# EAGLE design ESPF (EAGLE 9.6.2)
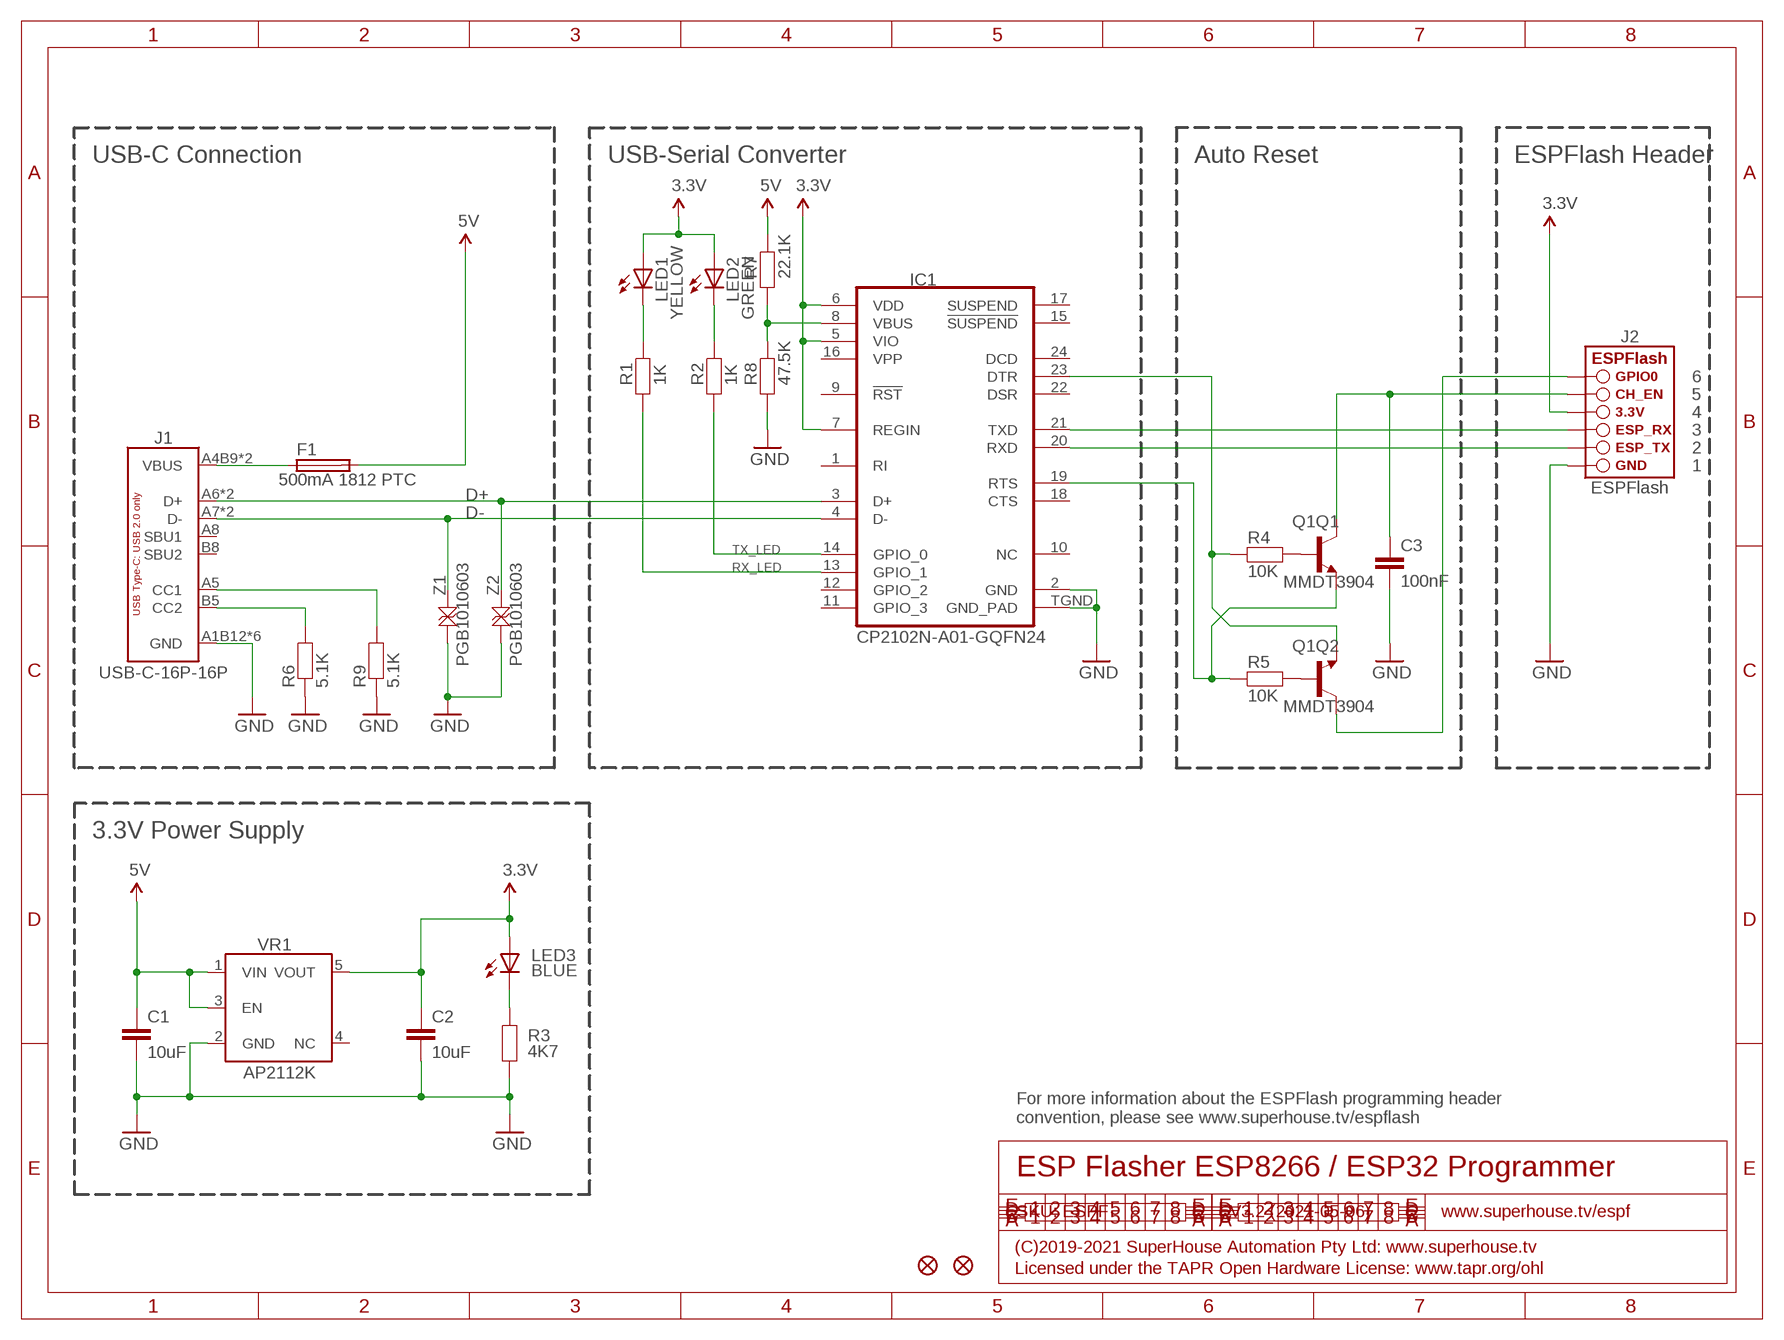
[diagram p0: schematic, sheet 1]

## Parts
C1  10uF  CAP0603  [C0603]
C2  10uF  CAP0603  [C0603]
C3  100nF  CAP0603  [C0603]
F1  500mA 1812 PTC  PTC050  [1812]
FID1  FIDUCIAL1X2.5  [FIDUCIAL-1X2.5]
FID2  FIDUCIAL1X2.5  [FIDUCIAL-1X2.5]
IC1  CP2102N-A01-GQFN24  CP2104  [QFN-24]
J1  USB-C-16P-16P  [USB-C-16P]
J2  ESPFLASH-1X6-2.54-PINS-RA  [1X6-2.54-PINS-RA]
LED1  YELLOW  LED0603  [LED-0603]
LED2  GREEN  LED0603  [LED-0603]
LED3  BLUE  LED0603  [LED-0603]
Q1  MMDT3904  TRANS_NPN_DUAL-MMDT3904  [SOT-363]
R1  1K  RESISTOR0603  [R0603]
R2  1K  RESISTOR0603  [R0603]
R3  4K7  RESISTOR0603  [R0603]
R4  10K  RESISTOR0603  [R0603]
R5  10K  RESISTOR0603  [R0603]
R6  5.1K  RESISTOR0603  [R0603]
R7  22.1K  RESISTOR0603  [R0603]
R8  47.5K  RESISTOR0603  [R0603]
R9  5.1K  RESISTOR0603  [R0603]
VR1  AP2112K-3.3  AP2112KSOT25  [SOT23-5]
Z1  PGB1010603  TVS0603  [TVS0603]
Z2  PGB1010603  TVS0603  [TVS0603]

## Nets
3.3V: C2.1 IC1.5(VIO) IC1.6(VDD) IC1.7(REGIN) J2.4(3.3V) LED1.A LED2.A LED3.A VR1.5(VOUT)
5V: C1.1 F1.2 R7.2 VR1.1(VIN) VR1.3(EN)
D+: IC1.3(D+) J1.A6(D+) J1.B6(D+) Z2.2
D-: IC1.4(D-) J1.A7(D-) J1.B7(D-) Z1.2
DTR: IC1.23(DTR) Q1.1(Q2:E) R4.1
EN: C3.1 J2.5(CH_EN) Q1.3(Q1:C)
GND: C1.2 C2.2 C3.2 IC1.2(GND) IC1.TGND(GND_PAD) J1.A1B12(GND) J1.A12B1(GND) J1.FIX1(GND) J1.FIX2(GND) J1.FIX3(GND) J1.FIX4(GND) J2.1(GND) R3.1 R6.1 R8.1 R9.1 VR1.2(GND) Z1.1 Z2.1
GPIO0: J2.6(GPIO0) Q1.6(Q2:C)
N$3: LED1.C R1.2
N$4: LED2.C R2.2
N$5: LED3.C R3.2
N$6: IC1.8(VBUS) R7.1 R8.2
N$7: Q1.5(Q1:B) R4.2
N$8: Q1.2(Q2:B) R5.2
N$9: J1.B5(CC2) R6.2
N$10: J1.A5(CC1) R9.2
RTS: IC1.19(RTS) Q1.4(Q1:E) R5.1
RX_LED: IC1.13(GPIO_1) R1.1
RXI: IC1.20(RXD) J2.2(ESP_TX)
TX_LED: IC1.14(GPIO_0) R2.1
TXO: IC1.21(TXD) J2.3(ESP_RX)
VIN: F1.1 J1.A4B9(VBUS) J1.A9B4(VBUS)
Unconnected: IC1.1(RI) IC1.9(!RST) IC1.10(NC) IC1.11(GPIO_3) IC1.12(GPIO_2) IC1.15(!SUSPEND) IC1.16(VPP) IC1.17(SUSPEND) IC1.18(CTS) IC1.22(DSR) IC1.24(DCD) J1.A8(SBU1) J1.B8(SBU2) VR1.4(NC)

## Notes on the sheet
- USB-C Connection | USB-Serial Converter | Auto Reset | ESPFlash Header
- 6
- 5
- 4
- 3
- 2
- 1
- 3.3V Power Supply
- For more information about the ESPFlash programming header
  convention, please see www.superhouse.tv/espflash
- ESP Flasher ESP8266 / ESP32 Programmer
- SKU: ESPF | V3.2 (2021-05-06) | www.superhouse.tv/espf
- (C)2019-2021 SuperHouse Automation Pty Ltd: www.superhouse.tv
- Licensed under the TAPR Open Hardware License: www.tapr.org/ohl

## Library data of the parts
C1-C3 = SuperHouse-DiscreteSemi:CAP: Capacitor Standard ceramic capacitor
F1 = SuperHouse-Fuses:PTC: MF-SMDF Series - PRC Resettable Fuses Source: http://www.farnell.com/datasheets/716597.pdf
FID1 FID2 = SuperHouse-Symbols:FIDUCIAL: Fiducial Alignment Points Various fiducial points for machine vision alignment.
IC1 = SuperHouse-ICs:CP2104: CP2104 / CP2102N-A01-GQFN24 CP2104 USB to serial converter. The CP2104 is not recommended for new designs: replace with CP2102N-A01-GQFN24.
J1 = SuperHouse-Connectors:USB-C-16P: USB-C socket with 16 pins, suitable only for backward compatibility with USB 2
J2 = SuperHouse-ESPFlash:ESPFLASH: ESPFlash ESPFlash programming header for ESP8266, ESP8285, and ESP32. Options for both 1x6 and 2x3 formats, in both 2.54mm (0.1") and 1.27mm (0.05") pitch.
LED1-LED3 = SuperHouse-LEDs:LED: LEDs Standard schematic elements and footprints for 5mm, 3mm, 1206, and 0603 sized LEDs. 5mm - Spark Fun Electronics SKU : COM-00529 (and others)
Q1 = SuperHouse-DiscreteSemi:TRANS_NPN_DUAL: MMDT3904 Dual 3904 NPN transistors. Datasheet <http://www.onsemi.com/pub_link/Collateral/MBT3904DW1T1-D.PDF>; PROD_ID: TRANS-13337
R1-R9 = SuperHouse-DiscreteSemi:RESISTOR: Resistor Standard resistors.
VR1 = SuperHouse-Regulators:AP2112K: AP2112K LDO linear voltage regulator
Z1 Z2 = SuperHouse-DiscreteSemi:TVS: TVS voltage protection Zener

## Net classes
0 default: width 0.152 mm, drill 0.241 mm, clearance 0.152 mm

## Board
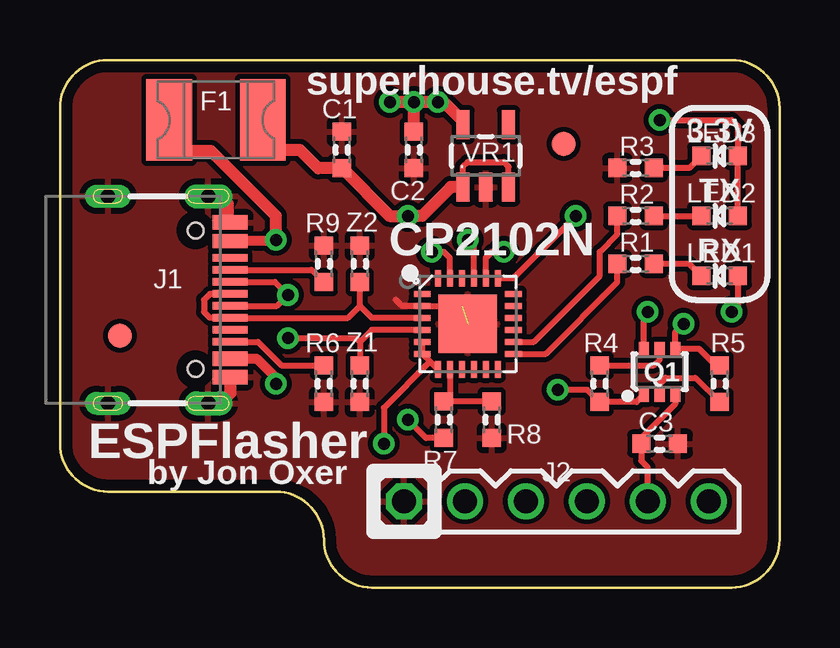
[diagram p1: board, top side]
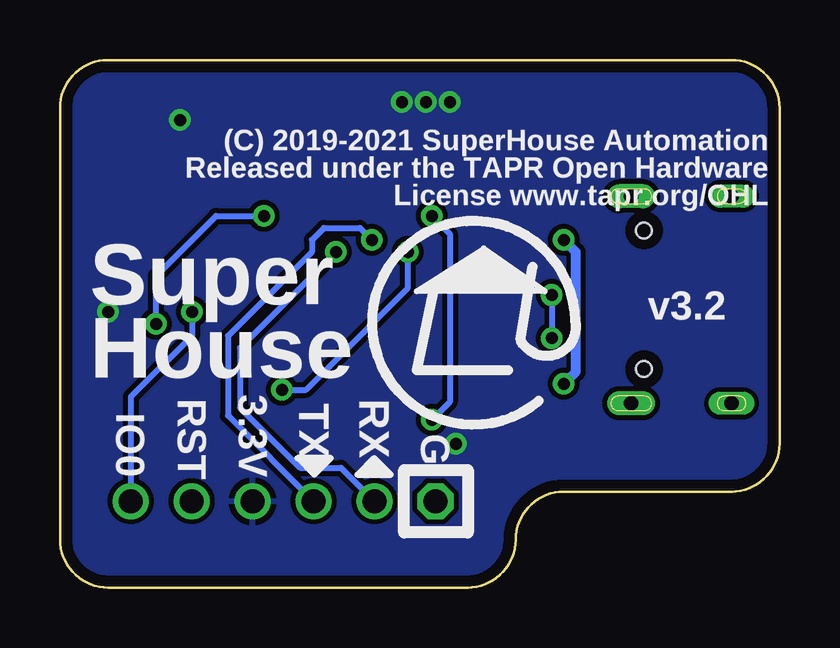
[diagram p2: board, bottom side, seen from below]

Size 30 x 22 mm. Coordinates in mm from the lower left corner, seen from the top.
Outline: 30,2 30,20 arc90 28,22 2,22 arc90 0,20 0,6 arc90 2,4 9,4 arc-90 11,2 arc90 13,0 28,0 arc90 30,2
Copper layers (1*16): Top 0.035mm / dielectric 1.5mm / Bottom 0.035mm
Design rules "SuperHouse-Design-Rules": minimum track width 10mil, minimum drill 24mil, track to track 8mil, track to pad 8mil, pad to pad 8mil, via to via 8mil, smd to smd 6mil, copper to edge 18mil, drill to drill 8mil, minimum pad ring 7mil, minimum via ring 8mil, stop-mask expansion 4mil, vias tented up to drill 0.5mm, thermal gap 10mil

### Footprints (pad centres in the part's own frame; a part is rotated, then mirrored left to right if it is on the bottom)
C0603 = smd 0.762 x 0.762: 1 -0.762,0; 2 0.762,0
1812 = smd 1.9 x 3.4: 1 -1.95,0; 2 1.95,0
FIDUCIAL-1X2.5 = smd 1 x 1: 1 0,0
QFN-24 = smd 0.25 x 0.7: 1 -1.25,-1.9; 2 -0.75,-1.9; 3 -0.25,-1.9; 4 0.25,-1.9; 5 0.75,-1.9; 6 1.25,-1.9; 13 1.25,1.9; 14 0.75,1.9; 15 0.25,1.9; 16 -0.25,1.9; 17 -0.75,1.9; 18 -1.25,1.9 | smd 0.7 x 0.25: 7 1.9,-1.25; 8 1.9,-0.75; 9 1.9,-0.25; 10 1.9,0.25; 11 1.9,0.75; 12 1.9,1.25; 19 -1.9,1.25; 20 -1.9,0.75; 21 -1.9,0.25; 22 -1.9,-0.25; 23 -1.9,-0.75; 24 -1.9,-1.25 | smd 2.45 x 2.45: TGND 0,0
USB-C-16P = smd 0.6 x 1.45: A1B12 -3.225,5.095; A4B9 -2.45,5.095; A9B4 2.45,5.095; A12B1 3.225,5.095 | smd 0.3 x 1.45: A5 -1.25,5.095; A6 -0.25,5.095; A7 0.25,5.095; A8 1.25,5.095; B5 1.75,5.095; B6 0.75,5.095; B7 -0.75,5.095; B8 -1.75,5.095 | drill 0.6 pad 0.8 long: FIX1 -4.32,0; FIX4 4.32,0 | drill 0.6 pad 1 long: FIX2 -4.32,4.18; FIX3 4.32,4.18 | hole 0.65: 2.89,3.65; -2.89,3.65
1X6-2.54-PINS-RA = drill 1 octagon: 1 -6.35,0 | drill 1: 2 -3.81,0; 3 -1.27,0; 4 1.27,0; 5 3.81,0; 6 6.35,0
LED-0603 = smd 0.762 x 0.762: A -0.762,0; C 0.762,0
SOT-363 = smd 0.42 x 0.6: 1 -0.65,-0.95; 2 0,-0.95; 3 0.65,-0.95; 4 0.65,0.95; 5 0,0.95; 6 -0.65,0.95
R0603 = smd 0.762 x 0.762: 1 -0.762,0; 2 0.762,0
SOT23-5 = smd 0.55 x 1.2: 1 -0.95,-1.3; 2 0,-1.3; 3 0.95,-1.3; 4 0.95,1.3; 5 -0.95,1.3
TVS0603 = smd 0.762 x 0.762: 1 -0.762,0; 2 0.762,0

### Placement (x,y rotation side)
C1  11.75,18.25 90 top
C2  14.75,18.25 270 top
C3  25,6 0 top
F1  6.5,19.5 0 top
FID1  2.5,10.5 0 top
FID2  21,18.5 0 top
IC1  17,11 270 top
J1  2,12 270 top
J2  20.7,3.6 0 top
LED1  27.5,13 180 top
LED2  27.5,15.5 180 top
LED3  27.5,18 180 top
Q1  25,9 0 top
R1  24,13.5 0 top
R2  24,15.5 0 top
R3  24,17.5 0 top
R4  22.5,8.5 90 top
R5  27.5,8.5 270 top
R6  11,8.5 90 top
R7  16,7 270 top
R8  18,7 90 top
R9  11,13.5 270 top
VR1  17.75,18 0 top
Z1  12.5,8.5 90 top
Z2  12.5,13.5 270 top

### Tracks (layer width: path | path; a pad name or v marks a point on that pad's centre or on a via)
3.3V  (via drill 0.5)
  Top 0.254: LED1.A 28.26,11.76 v28,11.5 | IC1.5 IC1.6 15.43,9.43 | 15.43,9.43 IC1.7 | LED2.A LED3.A 28.26,19.24 28,19.5 v25,19.5 | 15.43,9.43 13.5,7.5 v13.5,6
  Top 0.508: v14.75,20.25 v13.75,20.25 | v14.75,20.25 v15.75,20.25 16,20.25 16.8,19.45 VR1.5 | C2.1 v14.75,20.25
  pour Bottom: 0,20 arc-90 2,22 28,22 arc-90 30,20 30,2 arc-90 28,0 13,0 arc-90 11,2 arc90 9,4 2,4 arc-90 0,6
5V  (via drill 0.5)
  Top 0.254: VR1.3 18.7,17.55 18.5,17.75 17,17.75 16.8,17.55 VR1.1 | R7.2 15.26,6.24 v14.5,7
  Top 0.508: VR1.1 16.3,16.7 15.1,15.5 v14.5,15.5 13.74,15.5 C1.1 10.76,17.49 10,18.25 8.45,18.25 F1.2
  Bottom 0.254: v14.5,15.5 13.75,14.75 13.75,7.75 v14.5,7
D+
  Top 0.254: 12.5,11.75 Z2.2 | J1.A6 6.25,12.25 6,12 6,11.5 6.25,11.25 J1.B6 12,11.25 12.5,11.75 | IC1.3 13,11.25 12.5,11.75
D-  (via drill 0.5)
  Top 0.254: 12.5,10.25 Z1.2 | J1.A7 9.05,11.75 v9.5,12.2 8.95,12.75 J1.B7 | 12.5,10.25 12.35,10.4 v9.5,10.4 | IC1.4 13,10.75 12.5,10.25
  Bottom 0.254: v9.5,12.2 v9.5,10.4
DTR  (via drill 0.5)
  Top 0.254: Q1.1 24.04,7.74 R4.1 21.99,8.25 v20.75,8.25 | IC1.23 16.25,13.75 16,14 v15.5,14
  Bottom 0.254: v20.75,8.25 19.75,8.25 15.5,12.5 v15.5,14
EN
  Top 0.254: J2.5 24.51,5.01 24.24,5.28 C3.1 24.24,6.24 25.65,7.65 Q1.3
GND  (1 unrouted)
  Top 0.254: 16.75,11.75 IC1.2 14.25,11.75 14,12
  Top 0.508: J1.A1B12 7,15.32 7,16 6.68,16.32 J1.FIX2 | J1.A12B1 7.09,8.1 6.68,7.68 J1.FIX3
  pour Top: 0,20 arc-90 2,22 28,22 arc-90 30,20 30,2 arc-90 28,0 13,0 arc-90 11,2 arc90 9,4 2,4 arc-90 0,6
GPIO0  (via drill 0.5)
  Top 0.254: Q1.6 24.35,11.35 v24.5,11.5
  Bottom 0.254: v24.5,11.5 24.5,10.5 27.05,7.95 J2.6
N$3
  Top 0.254: R1.2 26.24,13.5 LED1.C
N$4
  Top 0.254: R2.2 LED2.C
N$5
  Top 0.254: R3.2 26.24,17.5 LED3.C
N$6
  Top 0.254: R8.2 R7.1 16.25,8.01 IC1.8
N$7
  Top 0.254: R4.2 24.76,9.26 25,9.5 Q1.5
N$8
  Top 0.254: Q1.2 25,8.5 25.25,8.75 26.49,8.75 R5.2
N$9
  Top 0.254: J1.B5 8.25,10.25 9.24,9.26 R6.2
N$10
  Top 0.254: J1.A5 10.49,13.25 R9.2
RTS  (via drill 0.5)
  Top 0.254: R5.1 27.34,9.26 26.65,9.95 Q1.4 25.65,10.65 v26,11 | v21.5,15.5 18.9,12.9 IC1.19
  Bottom 0.254: v26,11 26,13 23.5,15.5 v21.5,15.5
RX_LED
  Top 0.254: IC1.13 20.25,9.75 23.24,12.74 R1.1
RXI  (via drill 0.5)
  Top 0.254: IC1.20 17.75,13.75 18,14 v18.5,14
  Bottom 0.254: v18.5,14 22.5,10 22.5,7.5 20,5 18.29,5 J2.2
TX_LED
  Top 0.254: IC1.14 19.75,10.25 22.5,13 22.5,14 23.24,14.74 R2.1
TXO  (via drill 0.5)
  Top 0.254: IC1.21 17.25,14.25 v17,14.5
  Bottom 0.254: v17,14.5 17.5,15 19,15 19.5,14.5 19.5,14 23,10.5 23,7.17 J2.3
VIN  (via drill 0.5)
  Top 0.406: J1.A9B4 8.2,9.55 9,8.75 v9,8.5 | v9,14.5 8.95,14.45 J1.A4B9 | 4.8,18.2 4.55,18.45 F1.1
  Top 0.508: v9,14.5 9,15.5 6.3,18.2 4.8,18.2
  Bottom 0.406: v9,8.5 8.5,9 8.5,14 v9,14.5

### Text on the board
tPlace: superhouse.tv/espf | 3.3V | TX | CP2102N | RX | ESPFlasher | by Jon Oxer
bPlace: (C) 2019-2021 SuperHouse Automation / Released under the TAPR Open Hardware / License www.tapr.org/OHL | v3.2 | Super / House | G | RX | TX | 3.3V | IO0 | RST
tValues: K | A | K | A | K | A